# EAGLE schematic interruptor_v1 (EAGLE 7.6.0)
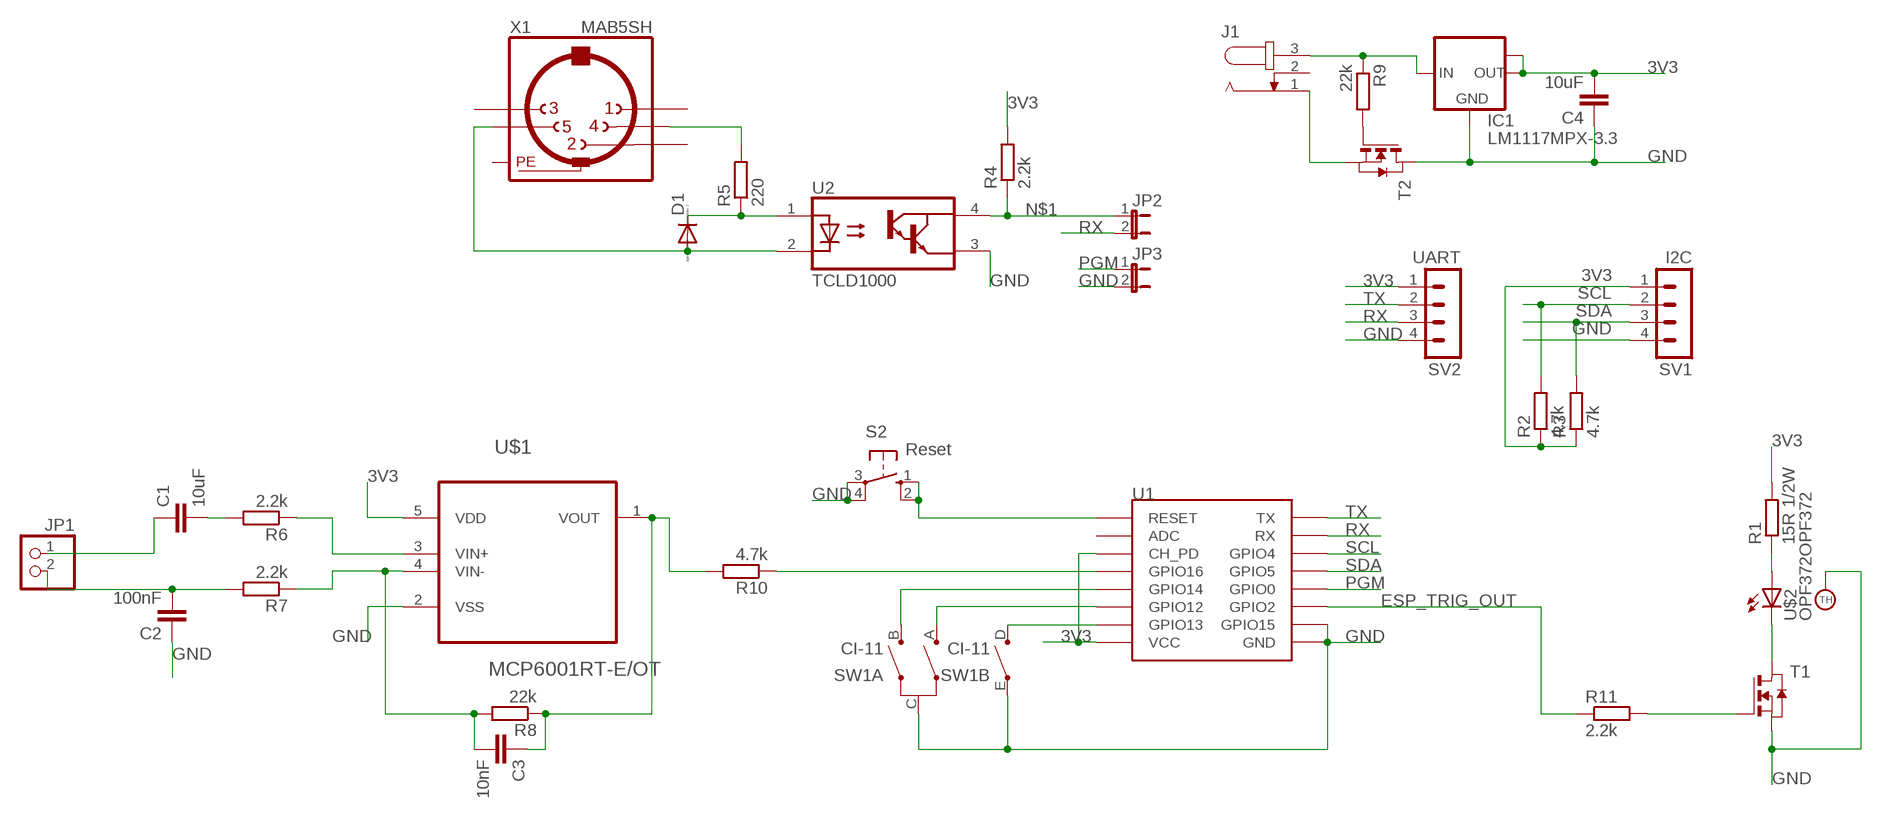
[diagram p0: schematic, sheet 1]

## Parts
C1  10uF  C-EUC0805  [C0805]
C2  100nF  C-EUC0805  [C0805]
C3  10nF  C-EUC0805  [C0805]
C4  10uF  C-EUC0805  [C0805]
D1  DIODE-DO214AA  [DO214AA]
IC1  LM1117MPX-3.3  [SOT223]
J1  JACK-PLUG0  [SPC4077]
JP1  PINHD-1X2  [1X02]
JP2  JP1E  [JP1]
JP3  JP1E  [JP1]
R1  15R 1/2W  R-EU_M0805  [M0805]
R2  4.7k  R-EU_M0805  [M0805]
R3  4.7k  R-EU_M0805  [M0805]
R4  2.2k  R-EU_M0805  [M0805]
R5  220  R-EU_M0805  [M0805]
R6  2.2k  R-EU_M0805  [M0805]
R7  2.2k  R-EU_M0805  [M0805]
R8  22k  R-EU_M0805  [M0805]
R9  22k  R-EU_M0805  [M0805]
R10  4.7k  R-EU_M0805  [M0805]
R11  2.2k  R-EU_M0805  [M0805]
S2  Reset  10-XX  [B3F-10XX]
SV1  I2C  MA04-1  [MA04-1]
SV2  UART  MA04-1  [MA04-1]
SW1  CI-11  [CI-11]
T1  NMOSSOT23  [SOT-23]
T2  NMOSSOT23  [SOT-23]
U1  ESP12SMD  [ESP12-SMD]
U2  TCLD1000  [SOIC254P1020X230-4N]
U$1  MCP6001RT-E/OT  [SOT95P270X145-5N]
U$2  OPF372OPF372  [OPF372]
X1  MAB5SH  [MAB5SH]

## Nets
3V3: C4.2 IC1.2(OUT) IC1.TAB(OUT1) R1.2 R2.1 R3.1 R4.2 SV1.1 SV2.1 U1.CH_PD U1.VCC U$1.5(VDD)
ESP_TRIG_OUT: R11.1 U1.GPIO2
GND: C2.1 C4.1 IC1.1(GND) JP3.2 S2.3(P) S2.4(P1) SV1.4 SV2.4 SW1.C(A:C) SW1.E(B:E) T1.2(S) T2.1(D) U1.GND U1.GPIO15 U2.3(E1) U$1.2(VSS) U$2.CASE(TH)
N$1: JP2.1 R4.1 U2.4(CO1)
N$2: R5.2 X1.4
N$3: D1.C R5.1 U2.1(A1)
N$4: D1.A U2.2(C1) X1.5
N$5: SW1.D(B:D) U1.GPIO13
N$6: C1.1 JP1.1
N$7: C2.2 JP1.2 R7.2
N$8: C1.2 R6.2
N$9: R6.1 U$1.3(VIN+)
N$10: C3.2 R7.1 R8.2 U$1.4(VIN-)
N$11: SW1.A(A:A) U1.GPIO12
N$12: C3.1 R8.1 R10.2 U$1.1(VOUT)
N$13: SW1.B(A:B) U1.GPIO14
N$14: T1.1(D) U$2.CATHODE(C)
N$15: S2.1(S) S2.2(S1) U1.RESET
N$16: R1.1 U$2.ANODE(A)
N$17: J1.1 T2.2(S)
N$18: IC1.3(IN) J1.3 R9.1
N$19: R9.2 T2.3(G)
N$20: R10.1 U1.GPIO16
N$21: R11.2 T1.3(G)
PGM: JP3.1 U1.GPIO0
RX: JP2.2 SV2.3 U1.RXD0(RX)
SCL: R2.2 SV1.2 U1.GPIO4
SDA: R3.2 SV1.3 U1.GPIO5
TX: SV2.2 U1.TXD0(TX)
Unconnected: J1.2 U1.ADC X1.1 X1.2 X1.3

## Power pins joined to a net without a drawn wire
PE: X1.PE X1.PE@(PE)

## Library data of the parts
C1-C4 = rcl:C-EU: CAPACITOR, European symbol
D1 = diode:DIODE-: DIODE
IC1 = lm1117:LM1117MPX-*
J1 = con-jack:JACK-PLUG: DC POWER JACK Power Jack, DC, Right Angle, Through Hole, Rated 5A at 16VDC, PC Terminals Distributor: Farnell (www.Farnell.de) Drawing: 84N1161.pdf / 84N1162.pdf Manufacturer: SPC Technology (www.spctechnology.com) Type: SPC4077 / SPC 4078; OC_FARNELL: unknown; OC_NEWARK: unknown
JP1 = pinhead:PINHD-1X2: PIN HEADER
JP2 JP3 = jumper:JP1E: JUMPER
R1-R11 = resistor:R-EU_: RESISTOR, European symbol
S2 = switch-omron:10-XX: OMRON SWITCH; MPN: B3F-1000; OC_FARNELL: 176432; OC_NEWARK: 36M3542
SV1 SV2 = con-lstb:MA04-1: PIN HEADER; OC_FARNELL: unknown; OC_NEWARK: unknown
SW1 = piher:CI-11: 11mm Incemental Encoder Source: www.piher.net .. 04-CI-11v04.pdf; OC_FARNELL: unknown; OC_NEWARK: unknown
T1 T2 = zetex:NMOSSOT23: MOS FET; OC_FARNELL: unknown; OC_NEWARK: unknown
U1 = esp8266modules:ESP12: ESP8266 Wifi module 12
U2 = TCLD1000:TCLD1000: Optocoupler, Photodarlington Output, SOP-4L, Long Mini-Flat Package; AVAILABILITY: Good; DESCRIPTION: Single Channel 35 V 5000 Vrms 600% CTR Photodarlington Optocoupler - SOP-4; MF: Vishay Semiconductor; MP: TCLD1000; PACKAGE: SOP-4 Vishay; PRICE: 0.35 USD
U$1 = MCP6001RT-E_OT:MCP6001RT-E/OT: 1 MHz, Low-Power Op Amp; AVAILABILITY: Good; DESCRIPTION: OP Amp Single GP R-R I/O 6V 5-Pin SOT-23 T/R; MF: Microchip; MP: MCP6001RT-E/OT; PACKAGE: SOT-23-5 Microchip; PRICE: 0.26 USD
U$2 = fibre:OPF372
X1 = con-hirschmann:MAB5SH: Female CONNECTOR 5 pins 90 deg. with shield, horizontal (DIN 41524); OC_FARNELL: 809883; OC_NEWARK: unknown